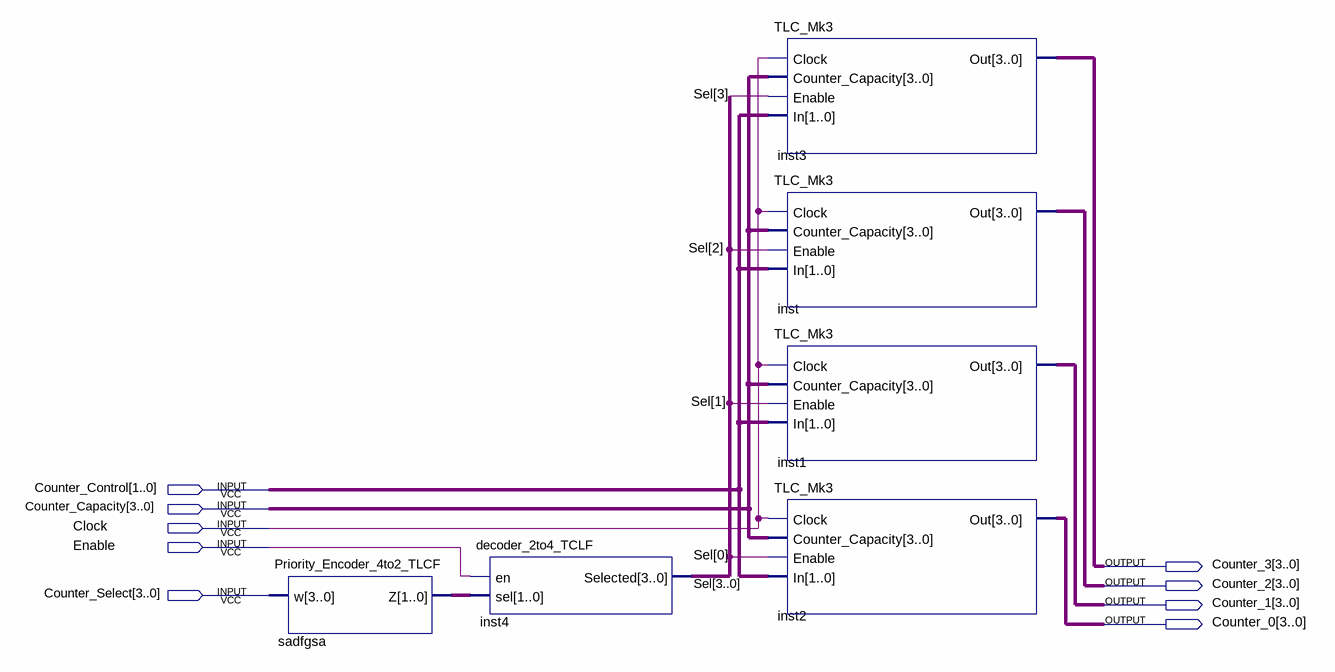
[diagram p0: schematic sheet]
// Quartus schematic TLCF.bdf as structural Verilog: 6 symbols, 9 pins
module TLCF (
  input  [1:0] Counter_Control,
  input  [3:0] Counter_Capacity,
  input  Clock,
  input  Enable,
  input  [3:0] Counter_Select,
  output [3:0] Counter_3,
  output [3:0] Counter_2,
  output [3:0] Counter_1,
  output [3:0] Counter_0
);

  wire [1:0] sadfgsa_z;
  wire [3:0] Sel;

  Priority_Encoder_4to2_TLCF sadfgsa (.w(Counter_Select), .Z(sadfgsa_z));
  decoder_2to4_TCLF inst4 (.en(Enable), .sel(sadfgsa_z), .Selected(Sel));
  TLC_Mk3 inst3 (
    .Clock(Clock), .Counter_Capacity(Counter_Capacity), .Enable(Sel[3]), .In(Counter_Control), .Out(Counter_3));
  TLC_Mk3 inst (
    .Clock(Clock), .Counter_Capacity(Counter_Capacity), .Enable(Sel[2]), .In(Counter_Control), .Out(Counter_2));
  TLC_Mk3 inst1 (
    .Clock(Clock), .Counter_Capacity(Counter_Capacity), .Enable(Sel[1]), .In(Counter_Control), .Out(Counter_1));
  TLC_Mk3 inst2 (
    .Clock(Clock), .Counter_Capacity(Counter_Capacity), .Enable(Sel[0]), .In(Counter_Control), .Out(Counter_0));
endmodule
